# Altium schematic sheet display.SchDoc
size A3; DocumentNumber: 1; SheetNumber: 1; SheetTotal: 1
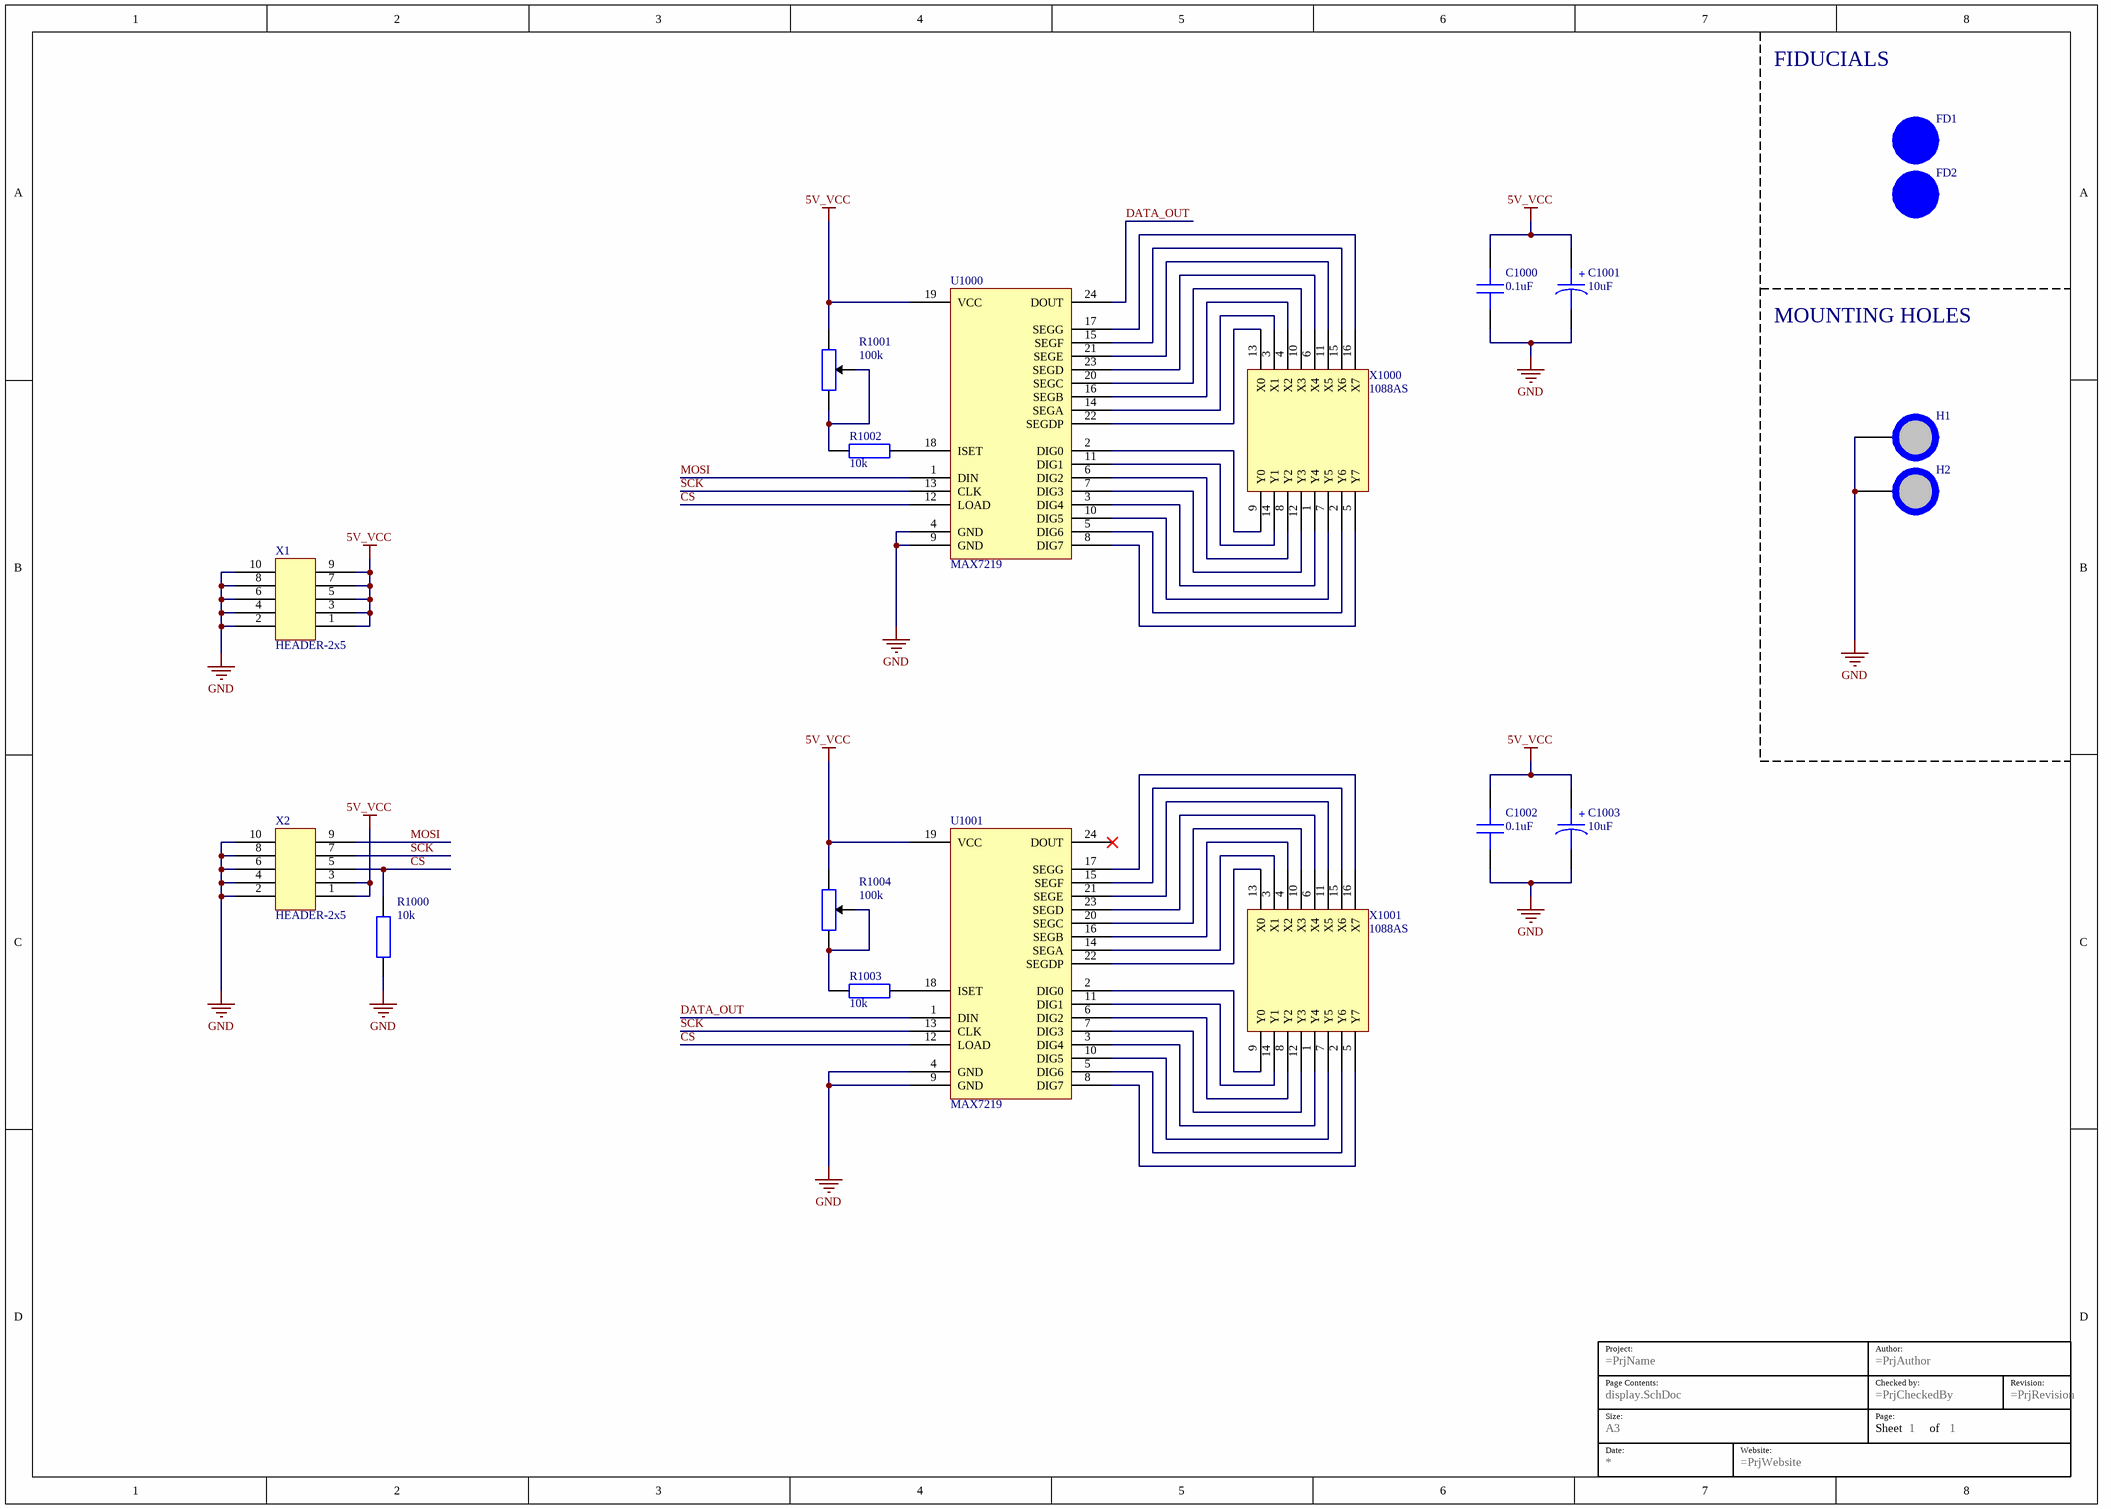
[diagram p0: display.SchDoc]

## Parts
*  Size: A3  (hidden comment: TITLE BLOCK)  (graphical)
C1000  0.1uF  [TH-CAPACITOR - ANGLE]
C1001  10uF  [TH-CAPACITOR - POL - ANGLE]
C1002  0.1uF  [TH-CAPACITOR - ANGLE]
C1003  10uF  [TH-CAPACITOR - POL - ANGLE]
FD1  FD  [FD]  (value not drawn)
FD2  FD  [FD]  (value not drawn)
H1  SIZE  [HOLE]  (value not drawn)
H2  SIZE  [HOLE]  (value not drawn)
R1000  10k  [AXIAL RESISTOR]
R1001  100k  [POTENTIOMETER]
R1002  10k  [AXIAL RESISTOR]
R1003  10k  [AXIAL RESISTOR]
R1004  100k  [POTENTIOMETER]
U1000  MAX7219  [DIP-24 WITH SOCKET]
U1001  MAX7219  [DIP-24 WITH SOCKET]
X1  HEADER-2x5  [HEADER-2x5-MALE]
X2  HEADER-2x5  [HEADER-2x5-MALE]
X1000  1088AS  [1088AS-DOT-MATRIX-8x8]
X1001  1088AS  [1088AS-DOT-MATRIX-8x8]

## Nets
5V_VCC: C1000.1 C1001.2 C1002.1 C1003.2 R1001.1 R1004.1 U1000.19(VCC) U1001.19(VCC) X1.1 X1.3 X1.5 X1.7 X1.9 X2.1 X2.3
GND: C1000.2 C1001.1 C1002.2 C1003.1 H1.1 H2.1 R1000.2 U1000.4(GND) U1000.9(GND) U1001.4(GND) U1001.9(GND) X1.2 X1.4 X1.6 X1.8 X1.10 X2.2 X2.4 X2.6 X2.8 X2.10
CS: R1000.1 U1000.12(LOAD) U1001.12(LOAD) X2.5
DATA_OUT: U1000.24(DOUT) U1001.1(DIN)
MOSI: U1000.1(DIN) X2.9
SCK: U1000.13(CLK) U1001.13(CLK) X2.7
NetR1001_2: R1001.2 R1001.3 R1002.1
NetR1002_2: R1002.2 U1000.18(ISET)
NetR1003_1: R1003.1 R1004.2 R1004.3
NetR1003_2: R1003.2 U1001.18(ISET)
NetU1000_2: U1000.2(DIG0) X1000.9(Y0)
NetU1000_3: U1000.3(DIG4) X1000.1(Y4)
NetU1000_5: U1000.5(DIG6) X1000.2(Y6)
NetU1000_6: U1000.6(DIG2) X1000.8(Y2)
NetU1000_7: U1000.7(DIG3) X1000.12(Y3)
NetU1000_8: U1000.8(DIG7) X1000.5(Y7)
NetU1000_10: U1000.10(DIG5) X1000.7(Y5)
NetU1000_11: U1000.11(DIG1) X1000.14(Y1)
NetU1000_14: U1000.14(SEGA) X1000.3(X1)
NetU1000_15: U1000.15(SEGF) X1000.15(X6)
NetU1000_16: U1000.16(SEGB) X1000.4(X2)
NetU1000_17: U1000.17(SEGG) X1000.16(X7)
NetU1000_20: U1000.20(SEGC) X1000.10(X3)
NetU1000_21: U1000.21(SEGE) X1000.11(X5)
NetU1000_22: U1000.22(SEGDP) X1000.13(X0)
NetU1000_23: U1000.23(SEGD) X1000.6(X4)
NetU1001_2: U1001.2(DIG0) X1001.9(Y0)
NetU1001_3: U1001.3(DIG4) X1001.1(Y4)
NetU1001_5: U1001.5(DIG6) X1001.2(Y6)
NetU1001_6: U1001.6(DIG2) X1001.8(Y2)
NetU1001_7: U1001.7(DIG3) X1001.12(Y3)
NetU1001_8: U1001.8(DIG7) X1001.5(Y7)
NetU1001_10: U1001.10(DIG5) X1001.7(Y5)
NetU1001_11: U1001.11(DIG1) X1001.14(Y1)
NetU1001_14: U1001.14(SEGA) X1001.3(X1)
NetU1001_15: U1001.15(SEGF) X1001.15(X6)
NetU1001_16: U1001.16(SEGB) X1001.4(X2)
NetU1001_17: U1001.17(SEGG) X1001.16(X7)
NetU1001_20: U1001.20(SEGC) X1001.10(X3)
NetU1001_21: U1001.21(SEGE) X1001.11(X5)
NetU1001_22: U1001.22(SEGDP) X1001.13(X0)
NetU1001_23: U1001.23(SEGD) X1001.6(X4)

Not connected (* = marked no-connect by the designer): FD1 1; FD2 1; U1001 24(DOUT)*

## Notes on the sheet
- FIDUCIALS
- MOUNTING HOLES
- (in symbol CAPACITOR POL) +
- (in symbol TITLE BLOCK) Project:; Author:; Page Contents:; Checked by:; Revision:; Size:; Page:; Sheet; of; Date:; Website:

## Library data of the parts
C1000 C1002 = CAPACITOR: GENERIC CAPACITOR
C1001 C1003 = CAPACITOR POL: POLARIZED CAPACITOR
FD1 FD2 = FD: FIDUCIAL MARKER
H1 H2 = MOUNTING-HOLE: M3 MOUNTING HOLE WITH SCREW AND SPACER
R1000 R1002 R1003 = RESISTOR: GENERIC RESISTOR
R1001 R1004 = POTMETER
U1000 U1001 = MAX7219: IC DRVR 7 SEGMNT 8 DIGIT 24SOIC; MF: Maxim Integrated; Digi-Key_Purchase_URL: https://www.digikey.com/product-detail/en/maxim-integrated/MAX7219CWG-T/MAX7219CWG-TCT-ND/4146791?utm_source=snapeda&utm_medium=aggregator&utm_campaign=symbol; Digi-Key_Part_Number: MAX7219CWG+TCT-ND; Package: DIP-24 Maxim Integrated; SnapEDA_Link: https://www.snapeda.com/parts/MAX7219/Maxim%20Integrated/view-part/481049/?ref=snap; MP: MAX7219; Value: *
X1 X2 = HEADER-2x5: 2.54mm HEADER 2x5; System: Connector
X1000 X1001 = 1088AS-DOT-MATRIX: 8x8 DOT MATRIX LED DISPLAY